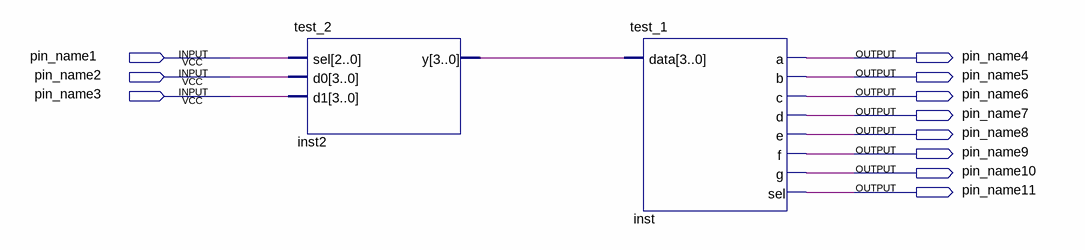
[diagram p0: schematic sheet]
// Quartus schematic test_3.bdf as structural Verilog: 2 symbols, 11 pins
module test_3 (
  input  pin_name1,
  input  pin_name2,
  input  pin_name3,
  output pin_name4,
  output pin_name5,
  output pin_name6,
  output pin_name7,
  output pin_name8,
  output pin_name9,
  output pin_name10,
  output pin_name11
);

  wire [3:0] inst2_y;

  test_2 inst2 (.sel({3{pin_name1}}), .d0({4{pin_name2}}), .d1({4{pin_name3}}), .y(inst2_y));
  test_1 inst (
    .data(inst2_y), .a(pin_name4), .b(pin_name5), .c(pin_name6), .d(pin_name7), .e(pin_name8), .f(pin_name9),
    .g(pin_name10), .sel(pin_name11));
endmodule
